# EAGLE schematic sma-to-bnc-feedthrough-v3 (EAGLE 9.6.1)
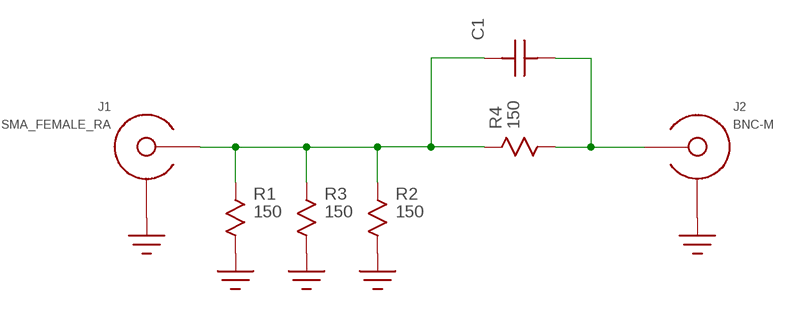
[diagram p0: schematic, sheet 1]

## Parts
C1  C0603  [C0603]
J1  SMA_FEMALE_RA  [SMA_RA_PCB]
J2  BNC-M  BNC_MALE_PCB  [BNC_MALE_PCB]
R1  150  R0603  [R0603]
R2  150  R0603  [R0603]
R3  150  R0603  [R0603]
R4  150  R0603  [R0603]

## Nets
GND: J1.SHIELD@1(SHIELD) J1.SHIELD@2(SHIELD) J1.SHIELD@3(SHIELD) J1.SHIELD@4(SHIELD) J2.SHIELD@1(SHIELD) J2.SHIELD@2(SHIELD) J2.SHIELD@3(SHIELD) J2.SHIELD@4(SHIELD) R1.P$2 R2.P$2 R3.P$2
N$1 [22-6]: C1.P$2 J1.CENTER R1.P$1 R2.P$1 R3.P$1 R4.P$1
N$2: C1.P$1 J2.CENTER R4.P$2

## Library data of the parts
C1 = yapo:C
J1 = yapo:SMA_FEMALE_RA
J2 = yapo:BNC_MALE_PCB
R1-R4 = yapo:R

## Net classes
1 22-6: width 0.559 mm, clearance 0.152 mm